# Altium schematic sheet MyNixie.SchDoc
size A2
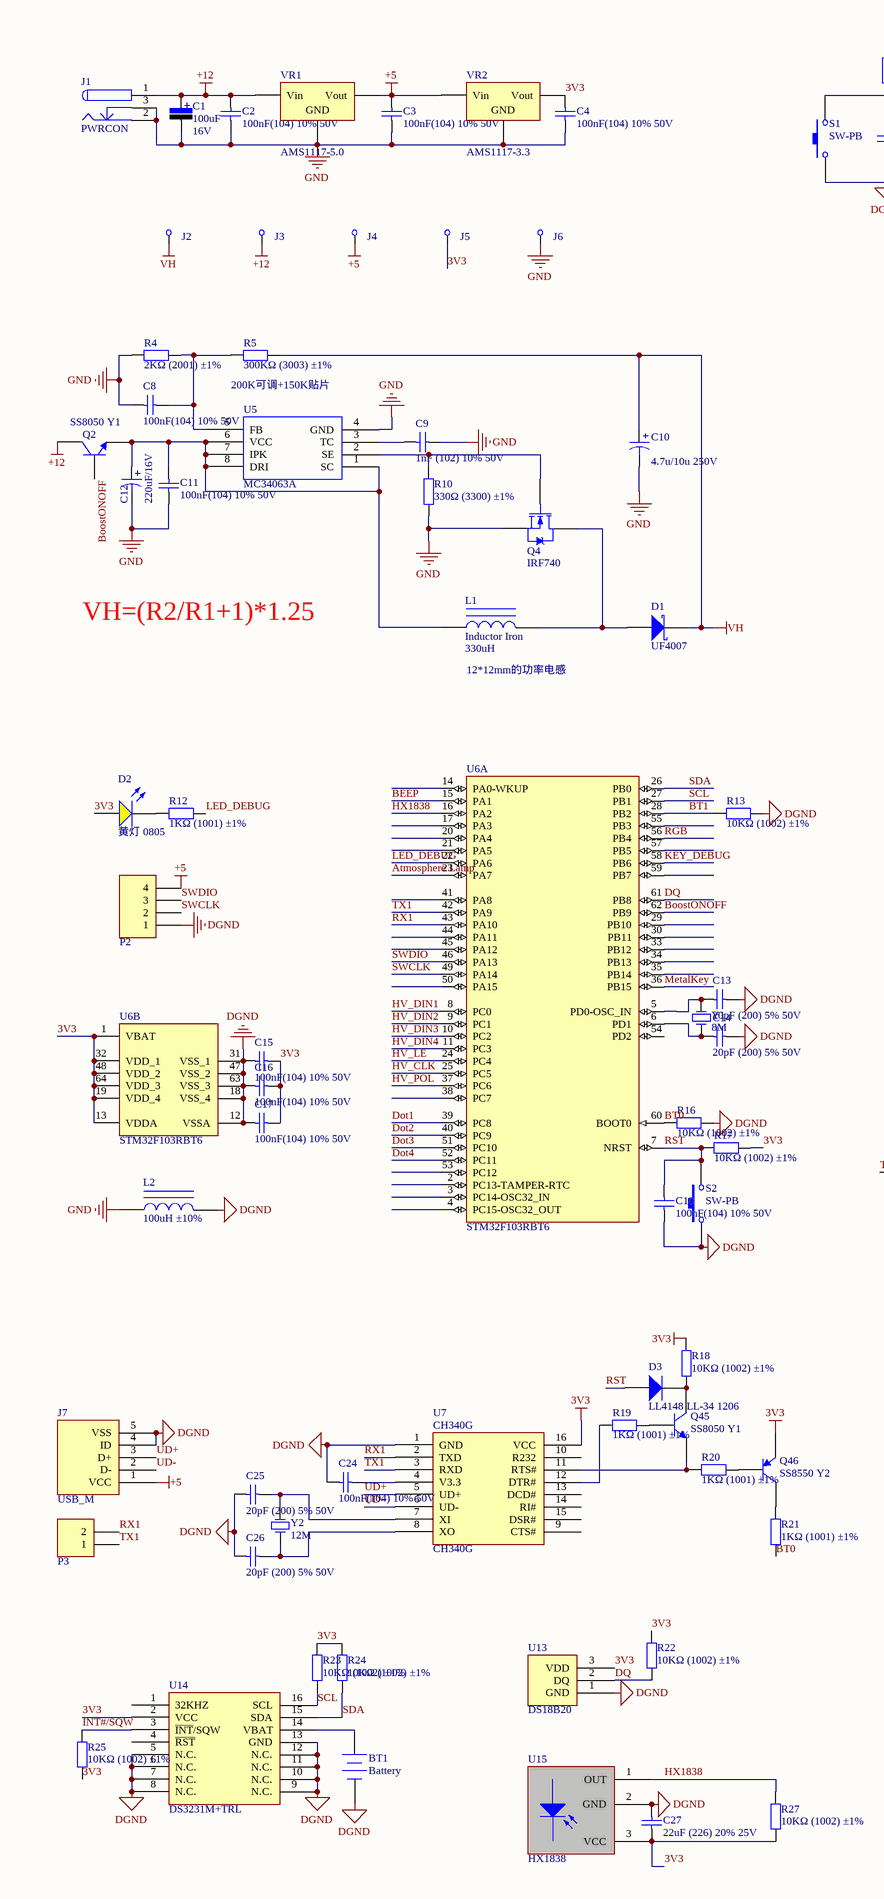
[diagram p0: MyNixie.SchDoc, left]
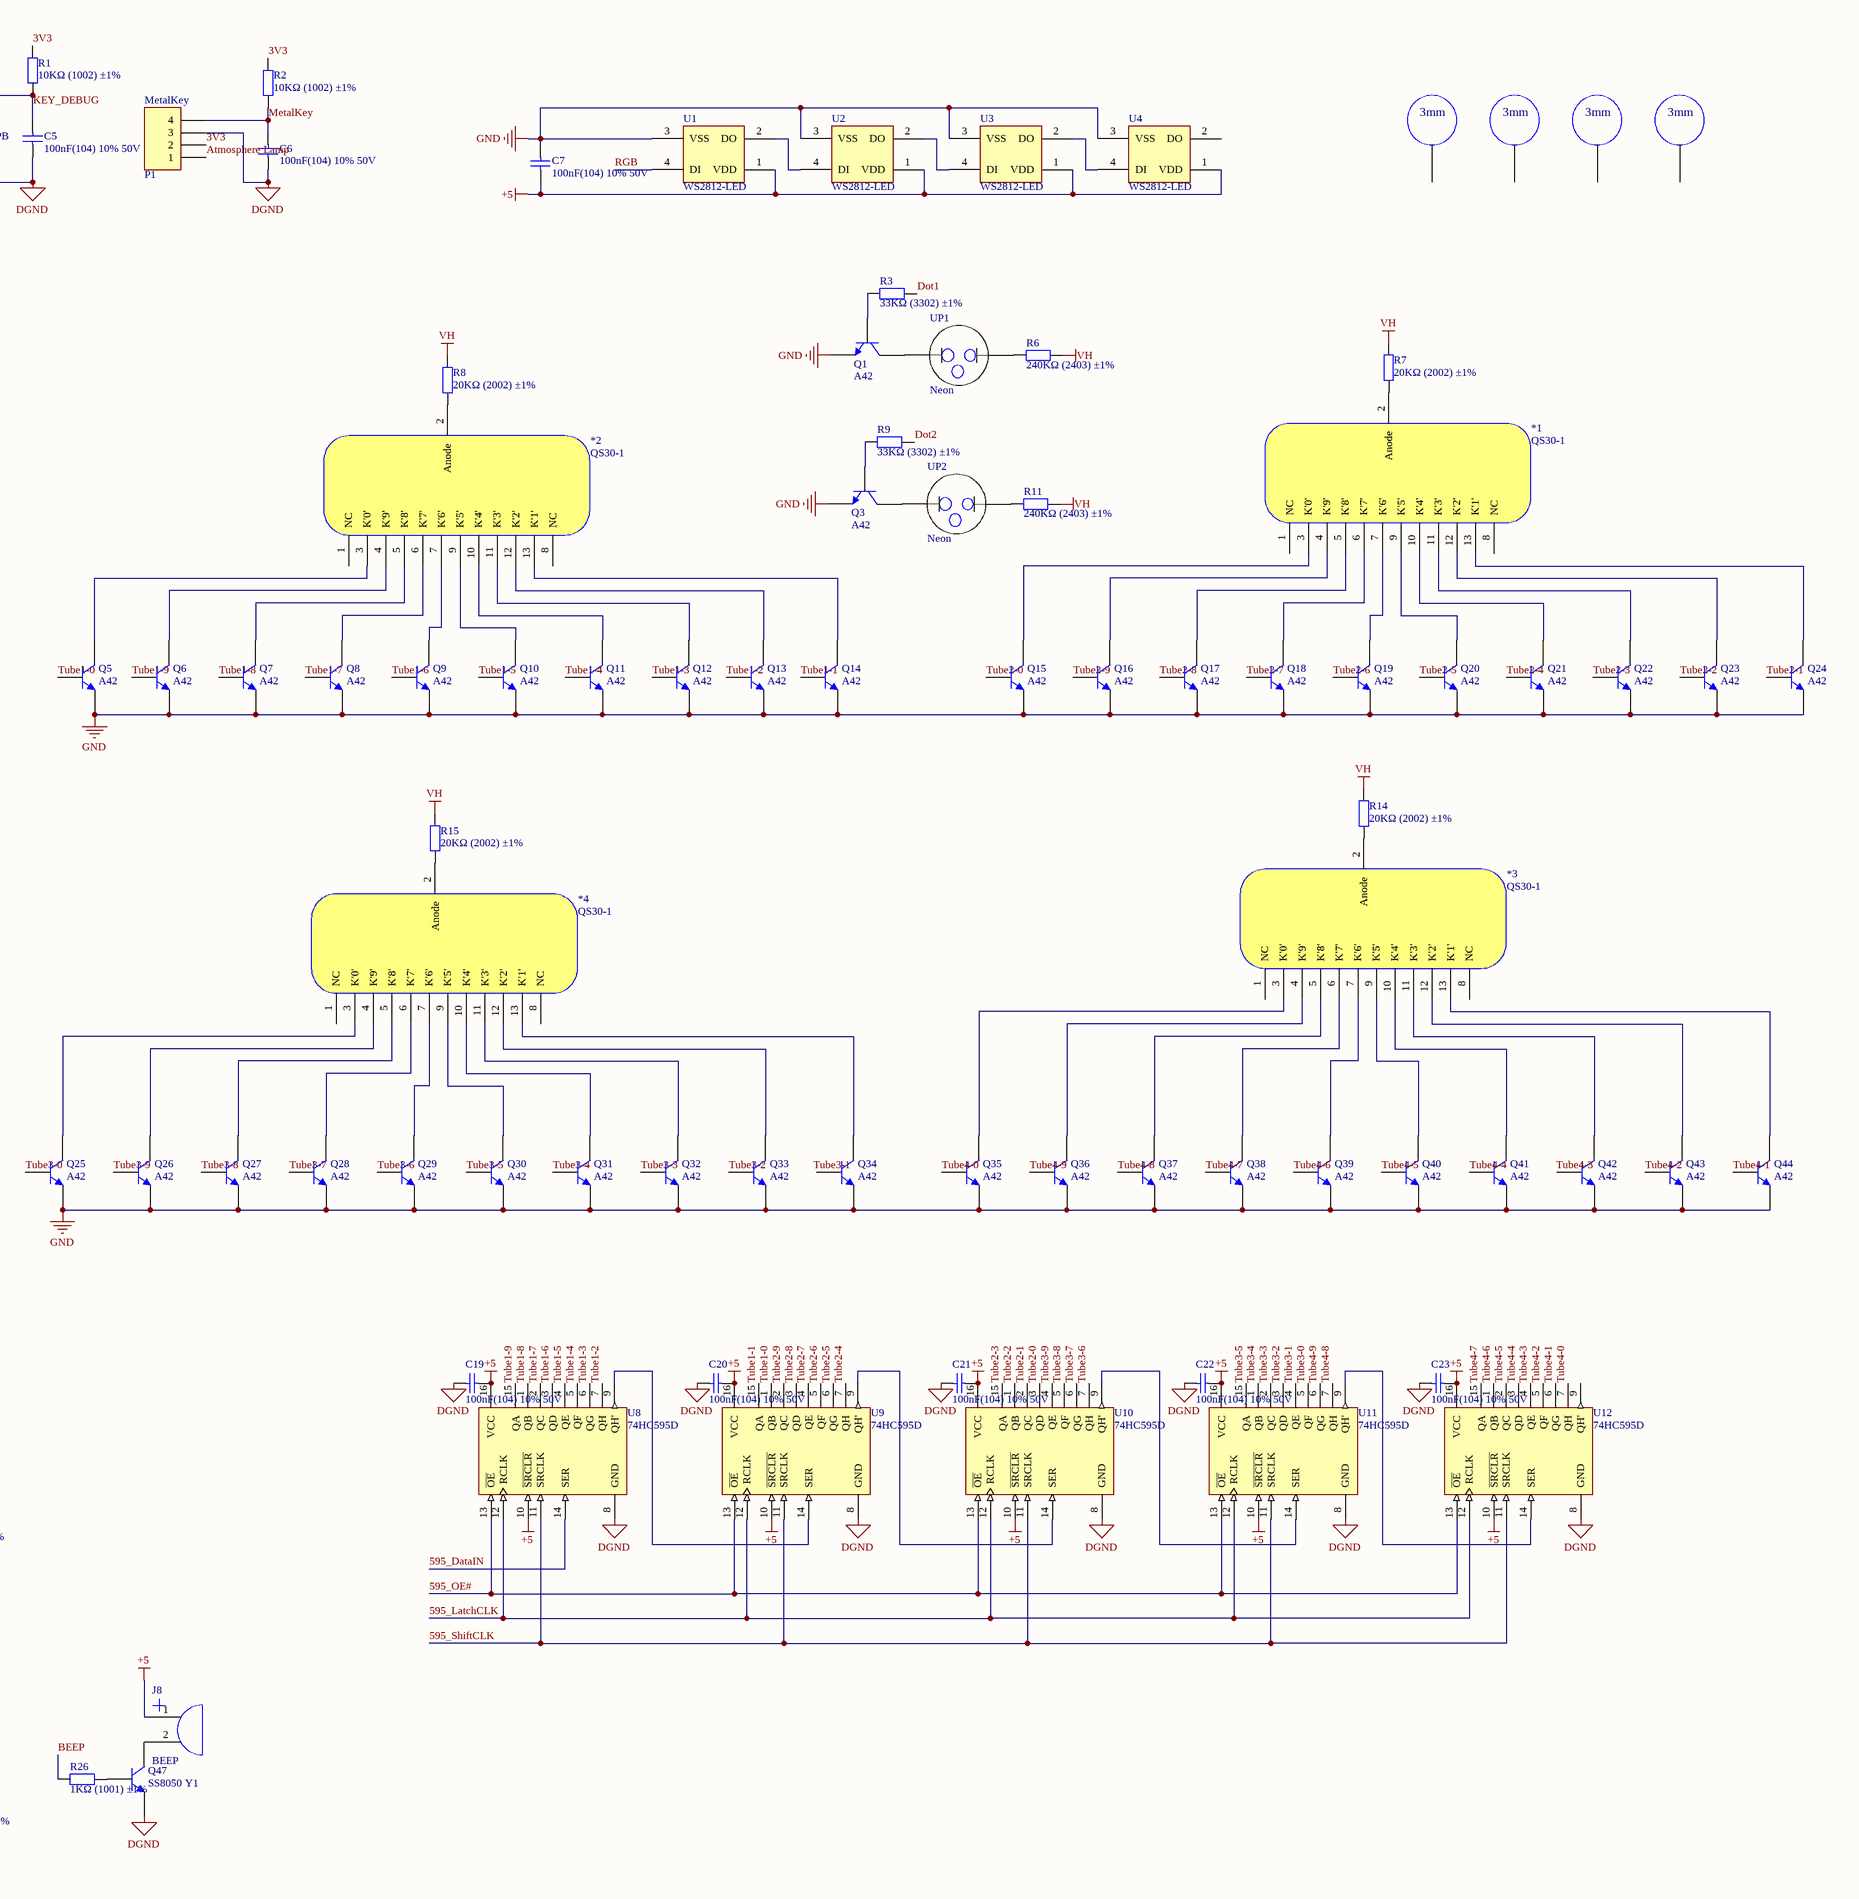
[diagram p1: MyNixie.SchDoc, right]

## Parts
*1  QS30-1  [QS30-1]
*2  QS30-1  [QS30-1]
*3  QS30-1  [QS30-1]
*4  QS30-1  [QS30-1]
BT1  Battery  [CR1220]
C1  value 100uF  Vol: 16V  [C-RB-10]  (hidden comment: Cap Pol)
C2  100nF(104) 10% 50V  [LC-0805_C]
C3  100nF(104) 10% 50V  [LC-0805_C]
C4  100nF(104) 10% 50V  [LC-0805_C]
C5  100nF(104) 10% 50V  [LC-0805_C]
C6  100nF(104) 10% 50V  [LC-0805_C]
C7  100nF(104) 10% 50V  [LC-0805_C]
C8  100nF(104) 10% 50V  [LC-0805_C]
C9  1nF (102) 10% 50V  [LC-0805_C]
C10  value 4.7u/10u 250V  [C-RB-10]  (hidden comment: Cap Pol1)
C11  100nF(104) 10% 50V  [LC-0805_C]
C12  value 220uF/16V  [C-RB-6]  (hidden comment: Cap Pol1)
C13  20pF (200) 5% 50V  [LC-0805_C]
C14  20pF (200) 5% 50V  [LC-0805_C]
C15  100nF(104) 10% 50V  [LC-0805_C]
C16  100nF(104) 10% 50V  [LC-0805_C]
C17  100nF(104) 10% 50V  [LC-0805_C]
C18  100nF(104) 10% 50V  [LC-0805_C]
C19  100nF(104) 10% 50V  [LC-0805_C]
C20  100nF(104) 10% 50V  [LC-0805_C]
C21  100nF(104) 10% 50V  [LC-0805_C]
C22  100nF(104) 10% 50V  [LC-0805_C]
C23  100nF(104) 10% 50V  [LC-0805_C]
C24  100nF(104) 10% 50V  [LC-0805_C]
C25  20pF (200) 5% 50V  [LC-0805_C]
C26  20pF (200) 5% 50V  [LC-0805_C]
C27  22uF (226) 20% 25V  [LC-0805_C]
D1  UF4007  [DO-41]
D2  黄灯 0805  [LC-0805_LED_S1]
D3  LL4148 LL-34 1206  [LC-LL-34]
J1  PWRCON  [DC-005]
J2  CHECK  [CHECK-A]  (value not drawn)
J3  CHECK  [CHECK-A]  (value not drawn)
J4  CHECK  [CHECK-A]  (value not drawn)
J5  CHECK  [CHECK-A]  (value not drawn)
J6  CHECK  [CHECK-A]  (value not drawn)
J7  USB_M  [USB_MICRO]
J8  BEEP  [Beep]
L1  Inductor Iron  value 330uH  [L-SMD-12]
L2  100uH ±10%  [LC-0805_L]
P1  MetalKey  [HDR4X1_A]
P2  Header 4  [HDR4X1_A]  (value not drawn)
P3  Header 2  [HDR2X1_A]  (value not drawn)
Q1  A42  [LC-SOT-23(SOT-23-3)]
Q2  SS8050 Y1  [LC-SOT-23(SOT-23-3)]
Q3  A42  [LC-SOT-23(SOT-23-3)]
Q4  IRF740  [TO-220AB]
Q5  A42  [LC-SOT-23(SOT-23-3)]
Q6  A42  [LC-SOT-23(SOT-23-3)]
Q7  A42  [LC-SOT-23(SOT-23-3)]
Q8  A42  [LC-SOT-23(SOT-23-3)]
Q9  A42  [LC-SOT-23(SOT-23-3)]
Q10  A42  [LC-SOT-23(SOT-23-3)]
Q11  A42  [LC-SOT-23(SOT-23-3)]
Q12  A42  [LC-SOT-23(SOT-23-3)]
Q13  A42  [LC-SOT-23(SOT-23-3)]
Q14  A42  [LC-SOT-23(SOT-23-3)]
Q15  A42  [LC-SOT-23(SOT-23-3)]
Q16  A42  [LC-SOT-23(SOT-23-3)]
Q17  A42  [LC-SOT-23(SOT-23-3)]
Q18  A42  [LC-SOT-23(SOT-23-3)]
Q19  A42  [LC-SOT-23(SOT-23-3)]
Q20  A42  [LC-SOT-23(SOT-23-3)]
Q21  A42  [LC-SOT-23(SOT-23-3)]
Q22  A42  [LC-SOT-23(SOT-23-3)]
Q23  A42  [LC-SOT-23(SOT-23-3)]
Q24  A42  [LC-SOT-23(SOT-23-3)]
Q25  A42  [LC-SOT-23(SOT-23-3)]
Q26  A42  [LC-SOT-23(SOT-23-3)]
Q27  A42  [LC-SOT-23(SOT-23-3)]
Q28  A42  [LC-SOT-23(SOT-23-3)]
Q29  A42  [LC-SOT-23(SOT-23-3)]
Q30  A42  [LC-SOT-23(SOT-23-3)]
Q31  A42  [LC-SOT-23(SOT-23-3)]
Q32  A42  [LC-SOT-23(SOT-23-3)]
Q33  A42  [LC-SOT-23(SOT-23-3)]
Q34  A42  [LC-SOT-23(SOT-23-3)]
Q35  A42  [LC-SOT-23(SOT-23-3)]
Q36  A42  [LC-SOT-23(SOT-23-3)]
Q37  A42  [LC-SOT-23(SOT-23-3)]
Q38  A42  [LC-SOT-23(SOT-23-3)]
Q39  A42  [LC-SOT-23(SOT-23-3)]
Q40  A42  [LC-SOT-23(SOT-23-3)]
Q41  A42  [LC-SOT-23(SOT-23-3)]
Q42  A42  [LC-SOT-23(SOT-23-3)]
Q43  A42  [LC-SOT-23(SOT-23-3)]
Q44  A42  [LC-SOT-23(SOT-23-3)]
Q45  SS8050 Y1  [LC-SOT-23(SOT-23-3)]
Q46  SS8550 Y2  [LC-SOT-23(SOT-23-3)]
Q47  SS8050 Y1  [LC-SOT-23(SOT-23-3)]
R1  10KΩ (1002) ±1%  [LC-0805_R]
R2  10KΩ (1002) ±1%  [LC-0805_R]
R3  33KΩ (3302) ±1%  [LC-0805_R]
R4  2KΩ (2001) ±1%  [LC-0805_R]
R5  300KΩ (3003) ±1%  [LC-0805_R]
R6  240KΩ (2403) ±1%  [LC-0805_R]
R7  20KΩ (2002) ±1%  [LC-0805_R]
R8  20KΩ (2002) ±1%  [LC-0805_R]
R9  33KΩ (3302) ±1%  [LC-0805_R]
R10  330Ω (3300) ±1%  [LC-0805_R]
R11  240KΩ (2403) ±1%  [LC-0805_R]
R12  1KΩ (1001) ±1%  [LC-0805_R]
R13  10KΩ (1002) ±1%  [LC-0805_R]
R14  20KΩ (2002) ±1%  [LC-0805_R]
R15  20KΩ (2002) ±1%  [LC-0805_R]
R16  10KΩ (1002) ±1%  [LC-0805_R]
R17  10KΩ (1002) ±1%  [LC-0805_R]
R18  10KΩ (1002) ±1%  [LC-0805_R]
R19  1KΩ (1001) ±1%  [LC-0805_R]
R20  1KΩ (1001) ±1%  [LC-0805_R]
R21  1KΩ (1001) ±1%  [LC-0805_R]
R22  10KΩ (1002) ±1%  [LC-0805_R]
R23  10KΩ (1002) ±1%  [LC-0805_R]
R24  10KΩ (1002) ±1%  [LC-0805_R]
R25  10KΩ (1002) ±1%  [LC-0805_R]
R26  1KΩ (1001) ±1%  [LC-0805_R]
R27  10KΩ (1002) ±1%  [LC-0805_R]
S1  SW-PB  [SW_PB2_A1]
S2  SW-PB  [SW_PB2_A1]
T1  M3铜柱螺丝孔  [螺丝孔-3mm]  (value not drawn)
T2  M3铜柱螺丝孔  [螺丝孔-3mm]  (value not drawn)
T3  M3铜柱螺丝孔  [螺丝孔-3mm]  (value not drawn)
T4  M3铜柱螺丝孔  [螺丝孔-3mm]  (value not drawn)
U1  WS2812-LED  [WS2812]
U2  WS2812-LED  [WS2812]
U3  WS2812-LED  [WS2812]
U4  WS2812-LED  [WS2812]
U5  MC34063A  [LC-SOIC-8_150mil]
U6  STM32F103RBT6  [LC-LQFP-64_10x10x05P]  (parts A,B of 2)
U7  CH340G  [LC-SOIC-16_150mil]
U8  74HC595D  [LC-SOIC-16_150mil]
U9  74HC595D  [LC-SOIC-16_150mil]
U10  74HC595D  [LC-SOIC-16_150mil]
U11  74HC595D  [LC-SOIC-16_150mil]
U12  74HC595D  [LC-SOIC-16_150mil]
U13  DS18B20  [TO-92A]
U14  DS3231M+TRL  [LC-SOIC-16_300mil]
U15  HX1838  [HS0038B]
UP1  Neon
UP2  Neon
VR1  AMS1117-5.0  [LC-SOT-223]
VR2  AMS1117-3.3  [LC-SOT-223]
Y1  value 8M  [X-HC49U]  (hidden comment: XTAL)
Y2  value 12M  [X-HC49U]  (hidden comment: XTAL)

## Nets
3V3: C4.2 C15.1 C16.1 C17.1 C27.1 D2.A J5.1 P1.2 Q46.2(E) R1.1 R2.1 R17.1 R18.2 R22.1 R23.1 R24.1 R25.2 R27.2 U6.1(VBAT) U6.13(VDDA) U6.19(VDD_4) U6.32(VDD_1) U6.48(VDD_2) U6.64(VDD_3) U7.16(VCC) U13.3(VDD) U14.2(VCC) U15.3(VCC) VR2.2(Vout)
+5: C3.2 C7.1 C19.1 C20.1 C21.1 C22.1 C23.1 J4.1 J7.1(VCC) J8.1 P2.4 U1.1(VDD) U2.1(VDD) U3.1(VDD) U4.1(VDD) U8.10(~{SRCLR}) U8.16(VCC) U9.10(~{SRCLR}) U9.16(VCC) U10.10(~{SRCLR}) U10.16(VCC) U11.10(~{SRCLR}) U11.16(VCC) U12.10(~{SRCLR}) U12.16(VCC) VR1.2(Vout) VR2.3(Vin)
+12: C1.1 C2.2 J1.1 J3.1 Q2.3(C) VR1.3(Vin)
DGND: BT1.2(-) C5.1 C6.1 C13.1 C14.1 C15.2 C16.2 C17.2 C18.1 C19.2 C20.2 C21.2 C22.2 C23.2 C24.2 C25.2 C26.2 C27.2 J7.4(ID) J7.5(VSS) L2.2 P1.3 P2.1 Q47.2(E) R13.1 R16.1 S1.1 S2.2 U6.12(VSSA) U6.18(VSS_4) U6.31(VSS_1) U6.47(VSS_2) U6.63(VSS_3) U7.1(GND) U8.8(GND) U9.8(GND) U10.8(GND) U11.8(GND) U12.8(GND) U13.1(GND) U14.5(N.C.) U14.6(N.C.) U14.7(N.C.) U14.8(N.C.) U14.9(N.C.) U14.10(N.C.) U14.11(N.C.) U14.12(N.C.) U14.13(GND) U15.2(GND)
GND: C1.2 C2.1 C3.1 C4.1 C7.2 C8.1 C9.2 C10.2 C11.1 C12.2 J1.2 J1.3 J6.1 L2.1 Q1.2(E) Q3.2(E) Q4.3(S) Q5.2(E) Q6.2(E) Q7.2(E) Q8.2(E) Q9.2(E) Q10.2(E) Q11.2(E) Q12.2(E) Q13.2(E) Q14.2(E) Q15.2(E) Q16.2(E) Q17.2(E) Q18.2(E) Q19.2(E) Q20.2(E) Q21.2(E) Q22.2(E) Q23.2(E) Q24.2(E) Q25.2(E) Q26.2(E) Q27.2(E) Q28.2(E) Q29.2(E) Q30.2(E) Q31.2(E) Q32.2(E) Q33.2(E) Q34.2(E) Q35.2(E) Q36.2(E) Q37.2(E) Q38.2(E) Q39.2(E) Q40.2(E) Q41.2(E) Q42.2(E) Q43.2(E) Q44.2(E) R4.1 R10.1 U1.3(VSS) U2.3(VSS) U3.3(VSS) U4.3(VSS) U5.4(GND) VR1.1(GND) VR2.1(GND)
VH: C10.1 D1.2(K) J2.1 R5.2 R6.2 R7.2 R8.2 R11.2 R14.2 R15.2
595_DataIN: U8.14(SER)
595_LatchCLK: U8.12(RCLK) U9.12(RCLK) U10.12(RCLK) U11.12(RCLK) U12.12(RCLK)
595_OE#: U8.13(~{OE}) U9.13(~{OE}) U10.13(~{OE}) U11.13(~{OE}) U12.13(~{OE})
595_ShiftCLK: U8.11(SRCLK) U9.11(SRCLK) U10.11(SRCLK) U11.11(SRCLK) U12.11(SRCLK)
Atmosphere Lamp: P1.1 U6.23(PA7)
BEEP: R26.1 U6.15(PA1)
BoostONOFF: Q2.1(B) U6.62(PB9)
BT0: R16.2 R21.1 U6.60(BOOT0)
BT1: R13.2 U6.28(PB2)
Dot1: R3.1 U6.39(PC8)
Dot2: R9.2 U6.40(PC9)
Dot3: U6.51(PC10)
Dot4: U6.52(PC11)
DQ: R22.2 U6.61(PB8) U13.2(DQ)
HV_CLK: U6.25(PC5)
HV_DIN1: U6.8(PC0)
HV_DIN2: U6.9(PC1)
HV_DIN3: U6.10(PC2)
HV_DIN4: U6.11(PC3)
HV_LE: U6.24(PC4)
HV_POL: U6.37(PC6)
HX1838: R27.1 U6.16(PA2) U15.1(OUT)
INT#/SQW: R25.1 U14.3(~{INT}/SQW)
KEY_DEBUG: C5.2 R1.2 S1.2 U6.58(PB6)
LED_DEBUG: R12.2 U6.22(PA6)
MetalKey: C6.2 P1.4 R2.2 U6.36(PB15)
RGB: U1.4(DI) U6.56(PB4)
RST: C18.2 D3.1(A) R17.2 S2.1 U6.7(NRST)
RX1: P3.2 U6.43(PA10) U7.2(TXD)
SCL: R23.2 U6.27(PB1) U14.16(SCL)
SDA: R24.2 U6.26(PB0) U14.15(SDA)
SWCLK: P2.2 U6.49(PA14)
SWDIO: P2.3 U6.46(PA13)
Tube1-0: Q5.1(B) U9.1(QB)
Tube1-1: Q14.1(B) U9.15(QA)
Tube1-2: Q13.1(B) U8.7(QH)
Tube1-3: Q12.1(B) U8.6(QG)
Tube1-4: Q11.1(B) U8.5(QF)
Tube1-5: Q10.1(B) U8.4(QE)
Tube1-6: Q9.1(B) U8.3(QD)
Tube1-7: Q8.1(B) U8.2(QC)
Tube1-8: Q7.1(B) U8.1(QB)
Tube1-9: Q6.1(B) U8.15(QA)
Tube2-0: Q15.1(B) U10.3(QD)
Tube2-1: Q24.1(B) U10.2(QC)
Tube2-2: Q23.1(B) U10.1(QB)
Tube2-3: Q22.1(B) U10.15(QA)
Tube2-4: Q21.1(B) U9.7(QH)
Tube2-5: Q20.1(B) U9.6(QG)
Tube2-6: Q19.1(B) U9.5(QF)
Tube2-7: Q18.1(B) U9.4(QE)
Tube2-8: Q17.1(B) U9.3(QD)
Tube2-9: Q16.1(B) U9.2(QC)
Tube3-0: Q25.1(B) U11.5(QF)
Tube3-1: U11.4(QE)
Tube3-2: Q33.1(B) U11.3(QD)
Tube3-3: Q32.1(B) U11.2(QC)
Tube3-4: Q31.1(B) U11.1(QB)
Tube3-5: Q30.1(B) U11.15(QA)
Tube3-6: Q29.1(B) U10.7(QH)
Tube3-7: Q28.1(B) U10.6(QG)
Tube3-8: Q27.1(B) U10.5(QF)
Tube3-9: Q26.1(B) U10.4(QE)
Tube4-0: Q35.1(B) U12.7(QH)
Tube4-1: Q44.1(B) U12.6(QG)
Tube4-2: Q43.1(B) U12.5(QF)
Tube4-3: U12.4(QE)
Tube4-4: Q41.1(B) U12.3(QD)
Tube4-5: Q40.1(B) U12.2(QC)
Tube4-6: Q39.1(B) U12.1(QB)
Tube4-7: Q38.1(B) U12.15(QA)
Tube4-8: Q37.1(B) U11.7(QH)
Tube4-9: Q36.1(B) U11.6(QG)
TX1: P3.1 U6.42(PA9) U7.3(RXD)
UD+: J7.3(D+) U7.5(UD+)
UD-: J7.2(D-) U7.6(UD-)
Net*1_2: *1.2(Anode) R7.1
Net*1_3: *1.3(K'0') Q15.3(C)
Net*1_4: *1.4(K'9') Q16.3(C)
Net*1_5: *1.5(K'8') Q17.3(C)
Net*1_6: *1.6(K'7') Q18.3(C)
Net*1_7: *1.7(K'6') Q19.3(C)
Net*1_9: *1.9(K'5') Q20.3(C)
Net*1_10: *1.10(K'4') Q21.3(C)
Net*1_11: *1.11(K'3') Q22.3(C)
Net*1_12: *1.12(K'2') Q23.3(C)
Net*1_13: *1.13(K'1') Q24.3(C)
Net*2_2: *2.2(Anode) R8.1
Net*2_3: *2.3(K'0') Q5.3(C)
Net*2_4: *2.4(K'9') Q6.3(C)
Net*2_5: *2.5(K'8') Q7.3(C)
Net*2_6: *2.6(K'7') Q8.3(C)
Net*2_7: *2.7(K'6') Q9.3(C)
Net*2_9: *2.9(K'5') Q10.3(C)
Net*2_10: *2.10(K'4') Q11.3(C)
Net*2_11: *2.11(K'3') Q12.3(C)
Net*2_12: *2.12(K'2') Q13.3(C)
Net*2_13: *2.13(K'1') Q14.3(C)
Net*3_2: *3.2(Anode) R14.1
Net*3_3: *3.3(K'0') Q35.3(C)
Net*3_4: *3.4(K'9') Q36.3(C)
Net*3_5: *3.5(K'8') Q37.3(C)
Net*3_6: *3.6(K'7') Q38.3(C)
Net*3_7: *3.7(K'6') Q39.3(C)
Net*3_9: *3.9(K'5') Q40.3(C)
Net*3_10: *3.10(K'4') Q41.3(C)
Net*3_11: *3.11(K'3') Q42.3(C)
Net*3_12: *3.12(K'2') Q43.3(C)
Net*3_13: *3.13(K'1') Q44.3(C)
Net*4_2: *4.2(Anode) R15.1
Net*4_3: *4.3(K'0') Q25.3(C)
Net*4_4: *4.4(K'9') Q26.3(C)
Net*4_5: *4.5(K'8') Q27.3(C)
Net*4_6: *4.6(K'7') Q28.3(C)
Net*4_7: *4.7(K'6') Q29.3(C)
Net*4_9: *4.9(K'5') Q30.3(C)
Net*4_10: *4.10(K'4') Q31.3(C)
Net*4_11: *4.11(K'3') Q32.3(C)
Net*4_12: *4.12(K'2') Q33.3(C)
Net*4_13: *4.13(K'1') Q34.3(C)
NetBT1_1: BT1.1(+) U14.14(VBAT)
NetC8_2: C8.2 R4.2 R5.1 U5.5(FB)
NetC9_1: C9.1 U5.3(TC)
NetC11_2: C11.2 C12.1 L1.1 Q2.2(E) U5.1(SC) U5.6(VCC) U5.7(IPK) U5.8(DRI)
NetC13_2: C13.2 U6.5(PD0-OSC_IN) Y1.1(OSC1)
NetC14_2: C14.2 U6.6(PD1) Y1.2(OSC2)
NetC24_1: C24.1 U7.4(V3.3)
NetC25_1: C25.1 U7.7(XI) Y2.1(OSC1)
NetC26_1: C26.1 U7.8(XO) Y2.2(OSC2)
NetD1_1: D1.1(A) L1.2 Q4.2(D)
NetD2_K: D2.K R12.1
NetD3_2: D3.2(K) Q45.3(C) R18.1
NetJ8_2: J8.2 Q47.3(C)
NetQ1_1: Q1.1(B) R3.2
NetQ1_3: Q1.3(C) UP1.2
NetQ3_1: Q3.1(B) R9.1
NetQ3_3: Q3.3(C) UP2.2
NetQ4_1: Q4.1(G) R10.2 U5.2(SE)
NetQ45_1: Q45.1(B) R19.2
NetQ45_2: Q45.2(E) R20.1 U7.11(RTS#)
NetQ46_1: Q46.1(B) R20.2
NetQ46_3: Q46.3(C) R21.2
NetQ47_1: Q47.1(B) R26.2
NetR6_1: R6.1 UP1.1
NetR11_1: R11.1 UP2.1
NetR19_1: R19.1 U7.12(DTR#)
NetU1_2: U1.2(DO) U2.4(DI)
NetU2_2: U2.2(DO) U3.4(DI)
NetU3_2: U3.2(DO) U4.4(DI)
NetU8_9: U8.9(QH') U9.14(SER)
NetU9_9: U9.9(QH') U10.14(SER)
NetU10_9: U10.9(QH') U11.14(SER)
NetU11_9: U11.9(QH') U12.14(SER)

Not connected (* = marked no-connect by the designer): *1 1(NC) 8(NC); *2 1(NC) 8(NC); *3 1(NC) 8(NC); *4 1(NC) 8(NC); Q34 1(B); Q42 1(B); T1 1; T2 1; T3 1; T4 1; U4 2(DO); U6 2(PC13-TAMPER-RTC) 3(PC14-OSC32_IN) 4(PC15-OSC32_OUT) 14(PA0-WKUP) 17(PA3) 20(PA4) 21(PA5) 29(PB10) 30(PB11) 33(PB12) 34(PB13) 35(PB14) 38(PC7) 41(PA8) 44(PA11) 45(PA12) 50(PA15) 53(PC12) 54(PD2) 55(PB3) 57(PB5) 59(PB7); U7 9(CTS#) 10(R232) 13(DCD#) 14(RI#) 15(DSR#); U12 9(QH'); U14 1(32KHZ) 4(~{RST})

## Notes on the sheet
- 200K可调+150K贴片
- VH=(R2/R1+1)*1.25
- (near L1) 12*12mm的功率电感
- Labels drawn without touching a wire or pin: Tube3-1, Tube4-3
- (in symbol M3铜柱螺丝孔) 3mm

## Library data of the parts
*1-*4 = QS30-1: 南昌辉光管
BT1 = Battery: 备份电池; Published: 24-Mar-1999; LatestRevisionDate: 17-Jul-2002; LatestRevisionNote: Re-released for DXP Platform.; PackageReference: BAT-2; Publisher: Altium Limited
C1 = Cap Pol: 极性电解电容; Published: 8-Jun-2000; LatestRevisionDate: 17-Jul-2002; LatestRevisionNote: Re-released for DXP Platform.; PackageReference: RB7.6-15; Publisher: Altium Limited
C2-C8 C11 C15-C24 = 0805 100nF(104) 10% 50V: 贴片电容; ComponentLink1Description: 供应商链接; ComponentLink1URL: http://www.szlcsc.com/product/details_50686.html; Package: 0805; Supplier: LC; SuppliersPartNumber: C49678
C9 = 0805 1nF (102) 10% 50V: 贴片电容; ComponentLink1Description: 供应商链接; ComponentLink1URL: http://www.szlcsc.com/product/details_52223.html; Package: 0805; Supplier: LC; SuppliersPartNumber: C51210
C10 C12 = Cap Pol1: Polarized Capacitor (Radial); Published: 8-Jun-2000; LatestRevisionDate: 17-Jul-2002; LatestRevisionNote: Re-released for DXP Platform.; PackageReference: RB7.6-15; Publisher: Altium Limited; PackageDescription: Polarized Capacitor (Radial); 2 Leads
C13 C14 C25 C26 = 0805 20pF (200) 5% 50V: 贴片电容; ComponentLink1Description: 供应商链接; ComponentLink1URL: http://www.szlcsc.com/product/details_2150.html; Package: 0805; Supplier: LC; SuppliersPartNumber: C1798
C27 = 0805 22uF (226) 20% 25V: 贴片电容; ComponentLink1Description: 供应商链接; ComponentLink1URL: http://www.szlcsc.com/product/details_46786.html; Package: 0805; Supplier: LC; SuppliersPartNumber: C45783
D1 = D Schottky: Schottky Diode; Published: 8-Jun-2000; LatestRevisionDate: 17-Jul-2002; LatestRevisionNote: Re-released for DXP Platform.; PackageReference: SMB; Publisher: Altium Limited; PackageDescription: DO-214-AA/SMB; 2 C-Bend Leads; Body 5.3 x 3.6 mm, inc. leads (LxW); Code_JEDEC: DO-214-AA
D2 = 0805 黄灯: 发光二极管; ComponentLink1Description: 供应商链接; ComponentLink1URL: http://www.szlcsc.com/product/details_2669.html; Package: 0805; Supplier: LC; SuppliersPartNumber: C2296
D3 = LL-34 LL4148 LL-34 1206: 开关二极管; ComponentLink1Description: 供应商链接; ComponentLink1URL: http://www.szlcsc.com/product/details_10338.html; Package: LL-34; Supplier: LC; SuppliersPartNumber: C9808
J1 = PWRCON: 直流电源端子; Published: 17-Dec-2003; DatasheetDocument: 09-May-2002; Publisher: Altium Limited; ComponentLink1Description: Manufacturer Link; ComponentLink1URL: http://domino.kycon.com/internet/Products.html
J2-J6 = CHECK: 测试点
J7 = USB_M: MicroUSB接口
J8 = BEEP: 蜂鸣器
L1 = Inductor Iron: Magnetic-Core Inductor; Published: 24-Mar-1999; LatestRevisionDate: 17-Jul-2002; LatestRevisionNote: Re-released for DXP Platform.; PackageReference: AXIAL-0.9; Publisher: Altium Limited; PackageDescription: Axial Device, Thru-Hole; 2 Leads; 0.9 in Pin Spacing
L2 = 0805 100uH 10%: 贴片电感; ComponentLink1Description: 供应商链接; ComponentLink1URL: http://www.szlcsc.com/product/details_69137.html; Package: 0805; Supplier: LC; SuppliersPartNumber: C68035
P1 P2 = Header 4: 接插件; LatestRevisionDate: 17-Jul-2002; LatestRevisionNote: Re-released for DXP Platform.; Publisher: Altium Limited
P3 = Header 2: 接插件; LatestRevisionDate: 17-Jul-2002; LatestRevisionNote: Re-released for DXP Platform.; Publisher: Altium Limited
Q1-Q3 Q5-Q45 Q47 = SOT-23 SS8050 Y1: 三极管; ComponentLink1Description: 供应商链接; ComponentLink1URL: http://www.szlcsc.com/product/details_2507.html; Package: SOT-23; Supplier: LC; SuppliersPartNumber: C2150
Q4 = NMOS-2: N-Channel Power MOSFET; Note: Pin 2 is electrically connected to pin 4.; Published: 8-Jun-2000; LatestRevisionDate: 17-Jul-2002; LatestRevisionNote: Re-released for DXP Platform.; DatasheetVersion: PD-9.814; PackageVersion: Feb-1997; PackageReference: TO-220AB; Publisher: Altium Limited; PackageDescription: TO, Thru-Hole, Vertical, Heatsink Mounted; 3 In-Line Leads; Pitch 2.54 mm; ComponentLink1Description: Manufacturer Link; ComponentLink1URL: http://www.irf.com/
Q46 = SOT-23 SS8550 Y2: 三极管; ComponentLink1Description: 供应商链接; ComponentLink1URL: http://www.szlcsc.com/product/details_9037.html; Package: SOT-23; Supplier: LC; SuppliersPartNumber: C8542
R1 R2 R13 R16-R18 R22-R25 R27 = 0805 10KΩ (1002) 1%: 贴片电阻; ComponentLink1Description: 供应商链接; ComponentLink1URL: http://www.szlcsc.com/product/details_18102.html; Package: 0805; Supplier: LC; SuppliersPartNumber: C17414
R3 R9 = 0805 33KΩ (3302) 1%: 贴片电阻; ComponentLink1Description: 供应商链接; ComponentLink1URL: http://www.szlcsc.com/product/details_18321.html; Package: 0805; Supplier: LC; SuppliersPartNumber: C17633
R4 = 0805 2KΩ (2001) 1%: 贴片电阻; ComponentLink1Description: 供应商链接; ComponentLink1URL: http://www.szlcsc.com/product/details_18292.html; Package: 0805; Supplier: LC; SuppliersPartNumber: C17604
R5 = 0805 300KΩ (3003) 1%: 贴片电阻; ComponentLink1Description: 供应商链接; ComponentLink1URL: http://www.szlcsc.com/product/details_18304.html; Package: 0805; Supplier: LC; SuppliersPartNumber: C17616
R6 R11 = 0805 240KΩ (2403) 1%: 贴片电阻; ComponentLink1Description: 供应商链接; ComponentLink1URL: http://www.szlcsc.com/product/details_26567.html; Package: 0805; Supplier: LC; SuppliersPartNumber: C25824
R7 R8 R14 R15 = 0805 20KΩ (2002) 1%: 贴片电阻; ComponentLink1Description: 供应商链接; ComponentLink1URL: http://www.szlcsc.com/product/details_4735.html; Package: 0805; Supplier: LC; SuppliersPartNumber: C4328
R10 = 0805 330Ω (3300) 1%: 贴片电阻; ComponentLink1Description: 供应商链接; ComponentLink1URL: http://www.szlcsc.com/product/details_18318.html; Package: 0805; Supplier: LC; SuppliersPartNumber: C17630
R12 R19-R21 R26 = 0805 1KΩ (1001) 1%: 贴片电阻; ComponentLink1Description: 供应商链接; ComponentLink1URL: http://www.szlcsc.com/product/details_18201.html; Package: 0805; Supplier: LC; SuppliersPartNumber: C17513
S1 S2 = SW-PB: 微动开关; Published: 24-Mar-1999; LatestRevisionDate: 17-Jul-2002; LatestRevisionNote: Re-released for DXP Platform.; PackageReference: SPST-2; Publisher: Altium Limited
U6 = STM32F103RBT6: ARM; ComponentLink1Description: 供应商链接; ComponentLink1URL: http://www.szlcsc.com/product/details_9244.html; Package: LQFP-64_10x10x05P; Supplier: LC; SuppliersPartNumber: C8735
U7 = CH340G: USB; ComponentLink1Description: 供应商链接; ComponentLink1URL: http://www.szlcsc.com/product/details_14927.html; Package: SOIC-16_150mil; Supplier: LC; SuppliersPartNumber: C14267
U8-U12 = 74HC595D: 74系列逻辑芯片; ComponentLink1Description: 供应商链接; ComponentLink1URL: http://www.szlcsc.com/product/details_6413.html; Package: SOIC-16_150mil; Supplier: LC; SuppliersPartNumber: C5947
U13 = DS18B20: 温度传感器
U14 = DS3231M+TRL: 实时时钟; ComponentLink1Description: 供应商链接; ComponentLink1URL: http://www.szlcsc.com/product/details_38643.html; Package: SOIC-16_300mil; Supplier: LC; SuppliersPartNumber: C37663
U15 = HS0038B: 红外接收器
UP1 UP2 = Neon: 氖泡
VR1 = SOT-223 AMS1117-5.0: 低压差线性稳压(LDO); ComponentLink1Description: 供应商链接; ComponentLink1URL: http://www.szlcsc.com/product/details_6653.html; Package: SOT-223; Supplier: LC; SuppliersPartNumber: C6187
VR2 = SOT-223 AMS1117-3.3: 低压差线性稳压(LDO); ComponentLink1Description: 供应商链接; ComponentLink1URL: http://www.szlcsc.com/product/details_6652.html; Package: SOT-223; Supplier: LC; SuppliersPartNumber: C6186
Y1 Y2 = XTAL: 晶振; Published: 8-Jun-2000; LatestRevisionDate: 17-Jul-2002; LatestRevisionNote: Re-released for DXP Platform.; PackageReference: R38; Publisher: Altium Limited